# Altium schematic sheet SX1276Radio.SchDoc: Semtech SX1276 Radio
size A3; Author: Craig Hesling; DrawnBy: Craig Hesling; Revision: 3.1
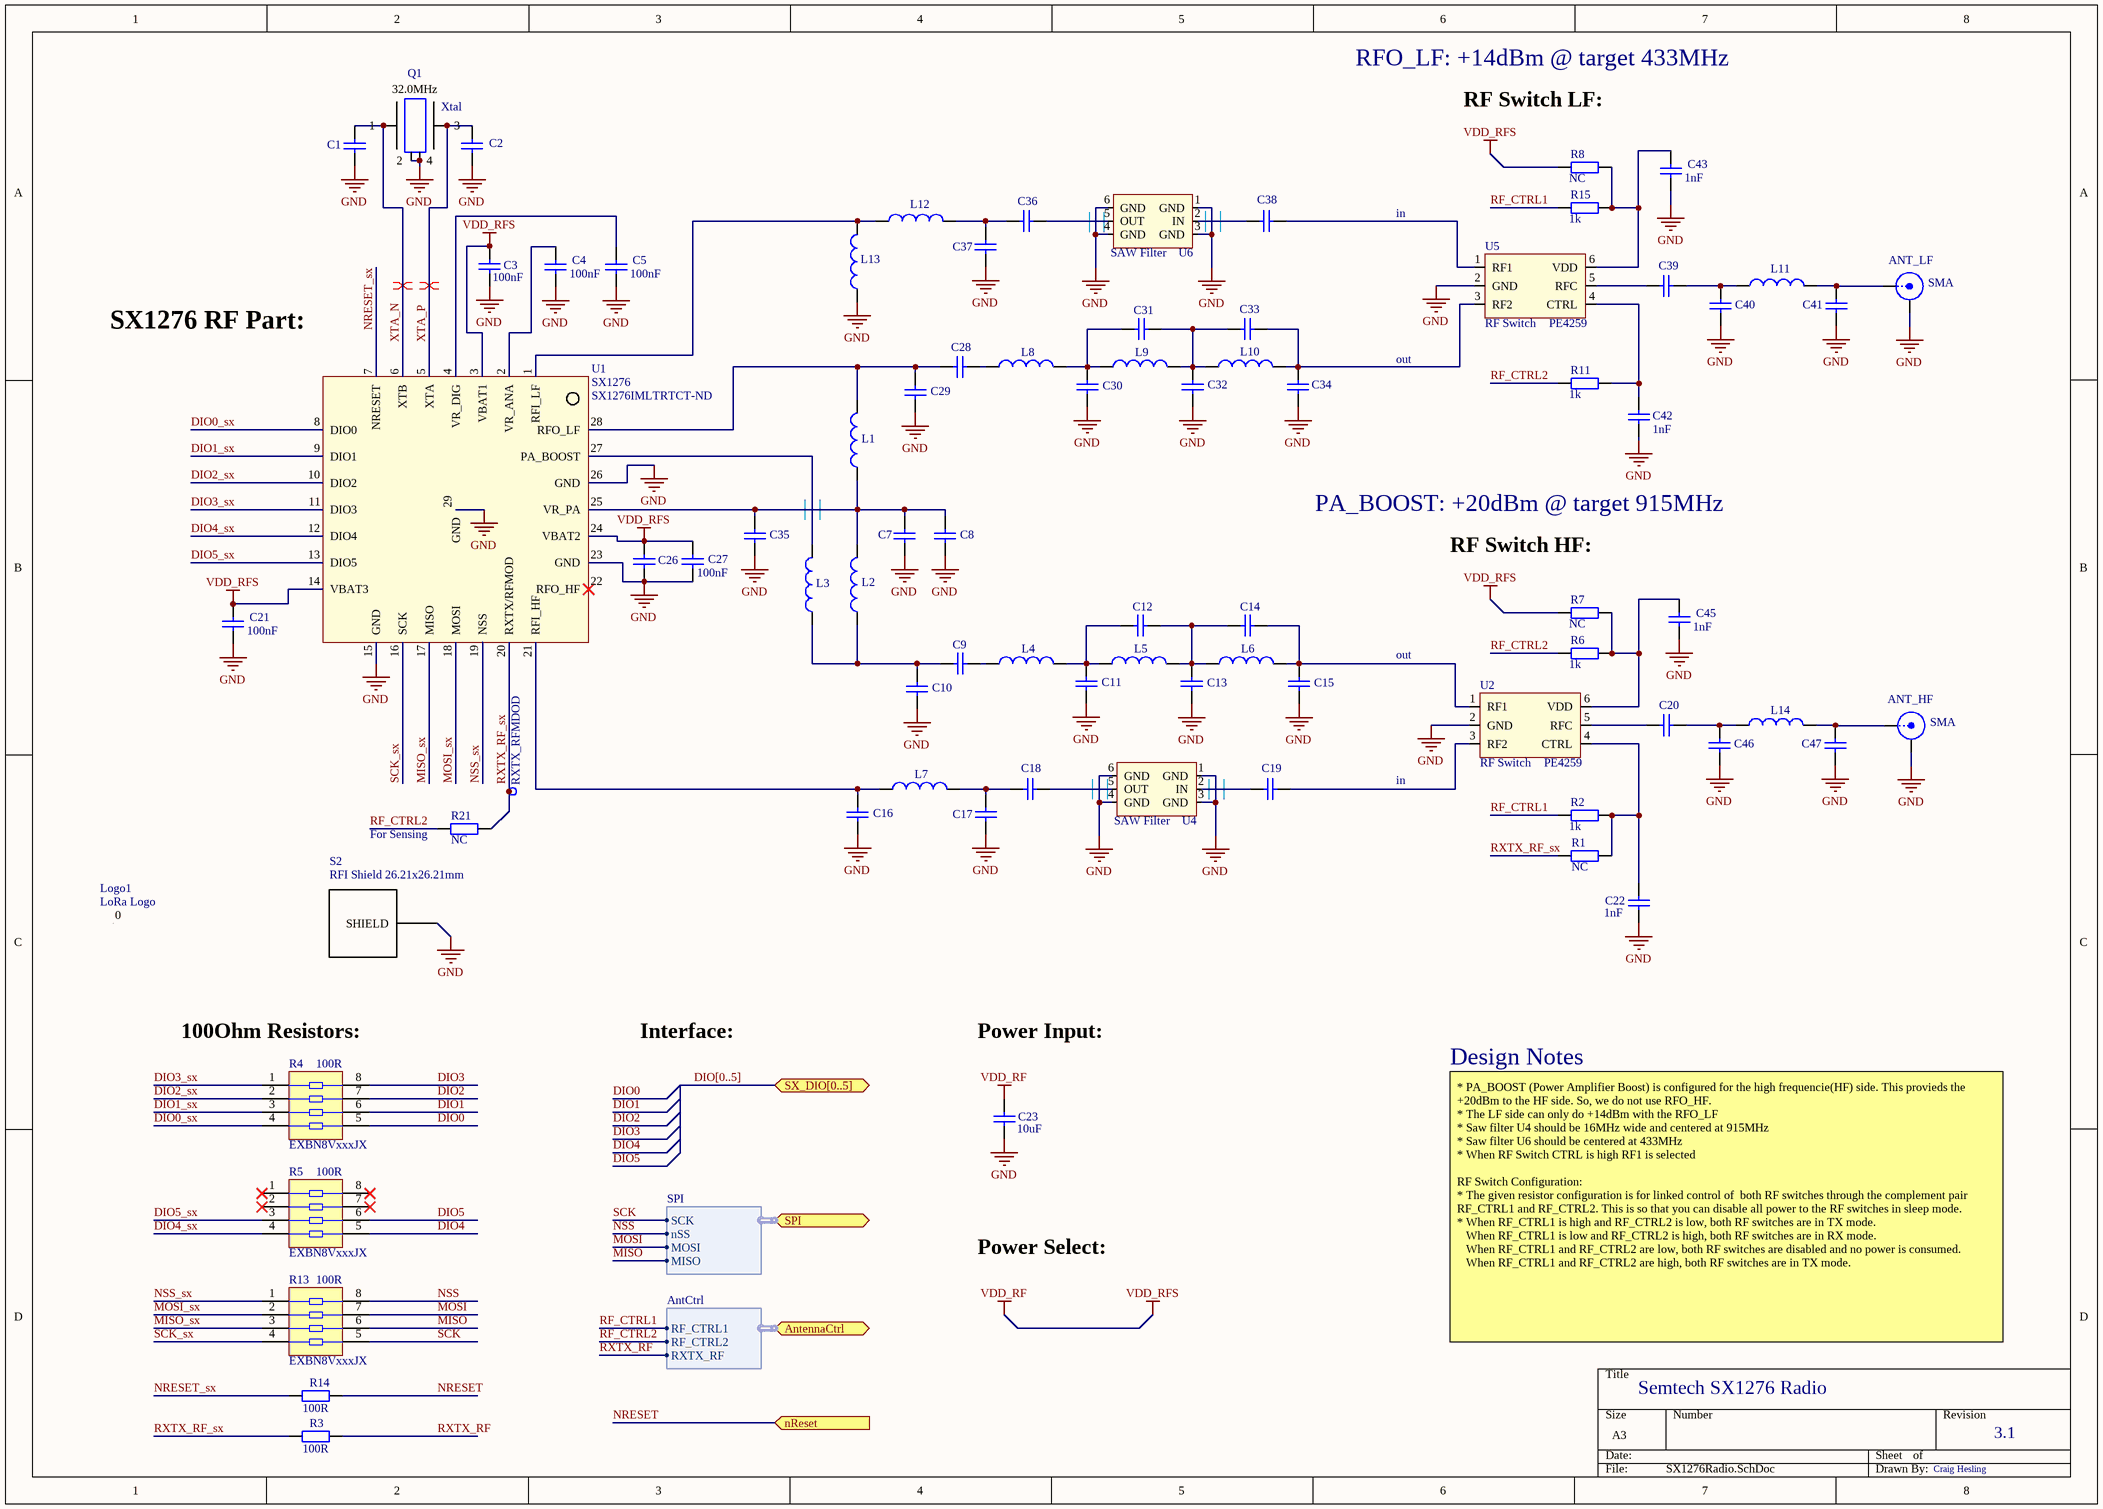
[diagram p0: SX1276Radio.SchDoc]

## Parts
ANT_HF  SMA  [SMA END LAUNCH JACK RECEPTACLE SHORT]
ANT_LF  SMA  [SMA END LAUNCH JACK RECEPTACLE SHORT]
C1  Cap  [rlc_402_smd]  (value not drawn)
C2  Cap  [rlc_402_smd]  (value not drawn)
C3  value 100nF  [rlc_402_smd]  (hidden comment: Cap)
C4  value 100nF  [rlc_402_smd]  (hidden comment: Cap)
C5  value 100nF  [rlc_402_smd]  (hidden comment: Cap)
C7  Cap  [rlc_402_smd]  (value not drawn)
C8  Cap  [rlc_402_smd]  (value not drawn)
C9  Cap  [rlc_402_smd]  (value not drawn)
C10  Cap  [rlc_402_smd]  (value not drawn)
C11  Cap  [rlc_402_smd]  (value not drawn)
C12  Cap  [rlc_402_smd]  (value not drawn)
C13  Cap  [rlc_402_smd]  (value not drawn)
C14  Cap  [rlc_402_smd]  (value not drawn)
C15  Cap  [rlc_402_smd]  (value not drawn)
C16  Cap  [rlc_402_smd]  (value not drawn)
C17  Cap  [rlc_402_smd]  (value not drawn)
C18  Cap  [rlc_402_smd]  (value not drawn)
C19  Cap  [rlc_402_smd]  (value not drawn)
C20  Cap  [rlc_402_smd]  (value not drawn)
C21  value 100nF  [rlc_402_smd]  (hidden comment: Cap)
C22  value 1nF  [rlc_402_smd]  (hidden comment: Cap)
C23  value 10uF  [rlc_805_smd]  (hidden comment: Cap)
C26  Cap  [rlc_402_smd]  (value not drawn)
C27  value 100nF  [rlc_402_smd]  (hidden comment: Cap)
C28  Cap  [rlc_402_smd]  (value not drawn)
C29  Cap  [rlc_402_smd]  (value not drawn)
C30  Cap  [rlc_402_smd]  (value not drawn)
C31  Cap  [rlc_402_smd]  (value not drawn)
C32  Cap  [rlc_402_smd]  (value not drawn)
C33  Cap  [rlc_402_smd]  (value not drawn)
C34  Cap  [rlc_402_smd]  (value not drawn)
C35  Cap  [rlc_402_smd]  (value not drawn)
C36  Cap  [rlc_402_smd]  (value not drawn)
C37  Cap  [rlc_402_smd]  (value not drawn)
C38  Cap  [rlc_402_smd]  (value not drawn)
C39  Cap  [rlc_402_smd]  (value not drawn)
C40  Cap  [rlc_402_smd]  (value not drawn)
C41  Cap  [rlc_402_smd]  (value not drawn)
C42  value 1nF  [rlc_402_smd]  (hidden comment: Cap)
C43  value 1nF  [rlc_402_smd]  (hidden comment: Cap)
C45  value 1nF  [rlc_402_smd]  (hidden comment: Cap)
C46  Cap  [rlc_402_smd]  (value not drawn)
C47  Cap  [rlc_402_smd]  (value not drawn)
L1  Inductor  [rlc_402_smd]  (value not drawn)
L2  Inductor  [rlc_402_smd]  (value not drawn)
L3  Inductor  [rlc_402_smd]  (value not drawn)
L4  Inductor  [rlc_402_smd]  (value not drawn)
L5  Inductor  [rlc_402_smd]  (value not drawn)
L6  Inductor  [rlc_402_smd]  (value not drawn)
L7  Inductor  [rlc_402_smd]  (value not drawn)
L8  Inductor  [rlc_402_smd]  (value not drawn)
L9  Inductor  [rlc_402_smd]  (value not drawn)
L10  Inductor  [rlc_402_smd]  (value not drawn)
L11  Inductor  [rlc_402_smd]  (value not drawn)
L12  Inductor  [rlc_402_smd]  (value not drawn)
L13  Inductor  [rlc_402_smd]  (value not drawn)
L14  Inductor  [rlc_402_smd]  (value not drawn)
Logo1  LoRa Logo  [Logo LoRa Size1]
Q1  Xtal  value 32.0MHz  [nd3225da - nd2520da]
R1  value NC  [rlc_402_smd]  (hidden comment: Resistor)
R2  value 1k  [rlc_402_smd]  (hidden comment: Resistor)
R3  value 100R  [rlc_402_smd]  (hidden comment: Resistor)
R4  EXBN8VxxxJX  value 100R  [EXB28V]
R5  EXBN8VxxxJX  value 100R  [EXB28V]
R6  value 1k  [rlc_402_smd]  (hidden comment: Resistor)
R7  value NC  [rlc_402_smd]  (hidden comment: Resistor)
R8  value NC  [rlc_402_smd]  (hidden comment: Resistor)
R11  value 1k  [rlc_402_smd]  (hidden comment: Resistor)
R13  EXBN8VxxxJX  value 100R  [EXB28V]
R14  value 100R  [rlc_402_smd]  (hidden comment: Resistor)
R15  value 1k  [rlc_402_smd]  (hidden comment: Resistor)
R21  value NC  [rlc_402_smd]  (hidden comment: Resistor)
RXTX_RFMDOD  Test Pin  [pin_SMD]  (value not drawn)
S2  RFI Shield 26.21x26.21mm  [RFI_SHIELD_26.21x26.21MM_Padded]
U1  SX1276  Supplier Part Number 1: SX1276IMLTRTCT-ND  [vqfn28_6x6mm_big_vias]
U2  RF Switch  value PE4259  [SC70-6]
U4  SAW Filter  [DCC6C_3.0x3.0mm]
U5  RF Switch  value PE4259  [SC70-6]
U6  SAW Filter  [DCC6C_3.0x3.0mm]

## Ports
AntennaCtrl (harness AntCtrl), nReset (in), SPI (harness SPI), SX_DIO[0..5] (bidir)

## Harnesses
SPI: SCK, nSS, MOSI, MISO
AntCtrl: RF_CTRL1, RF_CTRL2, RXTX_RF

## Nets
GND: ANT_HF.2(GND) ANT_LF.2(GND) C1.1 C2.1 C3.1 C4.1 C5.1 C7.1 C8.1 C10.1 C11.1 C13.1 C15.1 C16.1 C17.1 C21.1 C22.2 C23.1 C26.1 C27.1 C29.1 C30.1 C32.1 C34.1 C35.1 C37.1 C40.1 C41.1 C42.2 C43.1 C45.1 C46.1 C47.1 L13.1 Q1.2 Q1.4 S2.SHIELD U1.15(GND) U1.23(GND) U1.26(GND) U1.29(GND) U2.2(GND) U4.1(GND) U4.3(GND) U4.4(GND) U4.6(GND) U5.2(GND) U6.1(GND) U6.3(GND) U6.4(GND) U6.6(GND)
VDD_RF: C3.2 C21.2 C23.2 C26.2 C27.2 R7.2 R8.2 U1.3(VBAT1) U1.14(VBAT3) U1.24(VBAT2)  [also labelled VDD_RFS]
DIO0: R4.5
DIO0_sx: R4.4 U1.8(DIO0)
DIO1: R4.6
DIO1_sx: R4.3 U1.9(DIO1)
DIO2: R4.7
DIO2_sx: R4.2 U1.10(DIO2)
DIO3: R4.8
DIO3_sx: R4.1 U1.11(DIO3)
DIO4: R5.5
DIO4_sx: R5.4 U1.12(DIO4)
DIO5: R5.6
DIO5_sx: R5.3 U1.13(DIO5)
MISO: R13.6 ; port SPI.MISO
MISO_sx: R13.3 U1.17(MISO)
MOSI: R13.7 ; port SPI.MOSI
MOSI_sx: R13.2 U1.18(MOSI)
NRESET: R14.2 ; port nReset
NRESET_sx: R14.1 U1.7(NRESET)
NSS: R13.8 ; port SPI.nSS
NSS_sx: R13.1 U1.19(NSS)
RF_CTRL1: R2.2 R15.2 ; port AntennaCtrl.RF_CTRL1
RF_CTRL2: R6.2 R11.2 R21.2 ; port AntennaCtrl.RF_CTRL2
RXTX_RF: R3.2 ; port AntennaCtrl.RXTX_RF
RXTX_RF_sx: R1.1 R3.1 R21.1 RXTX_RFMDOD.1(pin) U1.20(RXTX/RFMOD)
SCK: R13.5 ; port SPI.SCK
SCK_sx: R13.4 U1.16(SCK)
XTA_N: C1.2 Q1.1 U1.6(XTB)
XTA_P: C2.2 Q1.3 U1.5(XTA)
NetANT_HF_1: ANT_HF.1(Signal) C47.2 L14.2
NetANT_LF_1: ANT_LF.1(Signal) C41.2 L11.2
NetC4_2: C4.2 U1.2(VR_ANA)
NetC5_2: C5.2 U1.4(VR_DIG)
NetC7_2: C7.2 C8.2 C35.2 L1.1 L2.2 U1.25(VR_PA)
NetC9_1: C9.1 L4.1
NetC9_2: C9.2 C10.2 L2.1 L3.1
NetC11_2: C11.2 C12.2 L4.2 L5.1
NetC12_1: C12.1 C13.2 C14.2 L5.2 L6.1
NetC14_1: C14.1 C15.2 L6.2 U2.1(RF1)
NetC16_2: C16.2 L7.1 U1.21(RFI_HF)
NetC17_2: C17.2 C18.2 L7.2
NetC18_1: C18.1 U4.5(OUT)
NetC19_1: C19.1 U2.3(RF2)
NetC19_2: C19.2 U4.2(IN)
NetC20_1: C20.1 C46.2 L14.1
NetC20_2: C20.2 U2.5(RFC)
NetC22_1: C22.1 R1.2 R2.1 U2.4(CTRL)
NetC28_1: C28.1 L8.1
NetC28_2: C28.2 C29.2 L1.2 U1.28(RFO_LF)
NetC30_2: C30.2 C31.2 L8.2 L9.1
NetC31_1: C31.1 C32.2 C33.2 L9.2 L10.1
NetC33_1: C33.1 C34.2 L10.2 U5.3(RF2)
NetC36_1: C36.1 U6.5(OUT)
NetC36_2: C36.2 C37.2 L12.2
NetC38_1: C38.1 U5.1(RF1)
NetC38_2: C38.2 U6.2(IN)
NetC39_1: C39.1 C40.2 L11.1
NetC39_2: C39.2 U5.5(RFC)
NetC42_1: C42.1 R11.1 U5.4(CTRL)
NetC43_2: C43.2 R8.1 R15.1 U5.6(VDD)
NetC45_2: C45.2 R6.1 R7.1 U2.6(VDD)
NetL3_2: L3.2 U1.27(PA_BOOST)
NetL12_1: L12.1 L13.2 U1.1(RFI_LF)

Not connected (* = marked no-connect by the designer): Logo1 0; R5 1* 2* 7* 8*; U1 22(RFO_HF)*

## Buses and harness runs
bus DIO[0..5] = port SX_DIO[0..5]

## Layout directives
differential pair: XTA_N, XTA_P

## Notes on the sheet
- RFO_LF: +14dBm @ target 433MHz
- RF Switch LF:
- in
- (near U1) SX1276 RF Part:
- out
- PA_BOOST: +20dBm @ target 915MHz
- RF Switch HF:
- (near R21) For Sensing
- (near R4) 100Ohm Resistors:
- Interface:
- Power Input:
- Design Notes
- Power Select:
- * PA_BOOST (Power Amplifier Boost) is configured for the high frequencie(HF) side. This provieds the +20dBm to the HF side. So, we do not use RFO_HF.
  * The LF side can only do +14dBm with the RFO_LF
  * Saw filter U4 should be 16MHz wide and centered at 915MHz
  * Saw filter U6 should be centered at 433MHz
  * When RF Switch CTRL is high RF1 is selected
  RF Switch Configuration:
  * The given resistor configuration is for linked control of  both RF switches through the complement pair RF_CTRL1 and RF_CTRL2. This is so that you can disable all power to the RF switches in sleep mode.
  * When RF_CTRL1 is high and RF_CTRL2 is low, both RF switches are in TX mode.
  When RF_CTRL1 is low and RF_CTRL2 is high, both RF switches are in RX mode.
  When RF_CTRL1 and RF_CTRL2 are low, both RF switches are disabled and no power is consumed.
  When RF_CTRL1 and RF_CTRL2 are high, both RF switches are in TX mode.

## Library data of the parts
ANT_HF ANT_LF = SMA: SMA Straight Connector; LatestRevisionDate: 05-oct-2007  -  Semtech; LatestRevisionNote: Re-released for DXP Platform.; Publisher: Altium Limited
C1 = Cap: Capacitor SMD; Value: 18pnF; Published: 8-Jun-2000; LatestRevisionDate: 05-oct-2007  -  Semtech; LatestRevisionNote: Re-released for DXP Platform.; Publisher: Altium Limited
C2 = Cap: Capacitor SMD; Value: 18pF; Published: 8-Jun-2000; LatestRevisionDate: 05-oct-2007  -  Semtech; LatestRevisionNote: Re-released for DXP Platform.; Publisher: Altium Limited
C3-C5 C21-C23 C27 C42 C43 C45 = Cap: Capacitor SMD; Published: 8-Jun-2000; LatestRevisionDate: 05-oct-2007  -  Semtech; LatestRevisionNote: Re-released for DXP Platform.; Publisher: Altium Limited
C7-C20 C28-C33 C35-C39 = Cap: Capacitor SMD; Value: 100nF; Published: 8-Jun-2000; LatestRevisionDate: 05-oct-2007  -  Semtech; LatestRevisionNote: Re-released for DXP Platform.; Publisher: Altium Limited
C26 = Cap: Capacitor SMD; Value: 100pF; Published: 8-Jun-2000; LatestRevisionDate: 05-oct-2007  -  Semtech; LatestRevisionNote: Re-released for DXP Platform.; Publisher: Altium Limited
C34 C40 C41 C46 C47 = Cap: Capacitor SMD; Value: NC; Published: 8-Jun-2000; LatestRevisionDate: 05-oct-2007  -  Semtech; LatestRevisionNote: Re-released for DXP Platform.; Publisher: Altium Limited
L1-L9 L12 L13 = Inductor: Inductor SMD; Code_IEC: 1005; Value: VAL?; Published: 8-Jun-2000; LatestRevisionDate: 05-oct-2007  -  Semtech; LatestRevisionNote: Re-released for DXP Platform.; Publisher: Altium Limited; Code_JEITA: 0402
L10 L11 L14 = Inductor: Inductor SMD; Code_IEC: 1005; Value: 0R; Published: 8-Jun-2000; LatestRevisionDate: 05-oct-2007  -  Semtech; LatestRevisionNote: Re-released for DXP Platform.; Publisher: Altium Limited; Code_JEITA: 0402
Logo1 = Logo: Schematic symbol for Logo
Q1 = Xtal GND: Crystal with GND pins; LatestRevisionDate: 05-oct-2007  -  Semtech
R1-R3 R6-R8 R11 R14 R15 R21 = Resistor: Resistor SMD - IEC symbol version; LatestRevisionDate: 27-Jul-20  -  Semtech
R4 R5 R13 = EXBN8VxxxJX: Mini-Flat Package, Isolated Resistor Network, 0.031 W/resistor; Supplier 1: Digi-Key; Supplier Part Number 1: Y10101TR-ND
RXTX_RFMDOD = test_pin: LatestRevisionDate: 05-oct-2007  -  Semtech
S2 = RFI_SHIELD_26.21x26.21mm: Supplier 1: Digi-Key; Supplier Part Number 1: 903-1008-1-ND
U1 = SX1276: SX1276 - Low Power Integrated UHF Transceiver with loRa Modem; LatestRevisionDate: 27-Jul-2009 -  Semtech; Supplier 1: Digi-Key
U2 U5 = PE4259 RF Switch: PE4259 Peregrine RF Switch; LatestRevisionDate: 03-Sep-2012 -  Semtech
U4 U6 = SAW Filter: SAW Filter - Bandpass - TEMEX type; LatestRevisionDate: 05-oct-2007  -  Semtech